# Altium schematic sheet DSP_Header.SchDoc
size A4
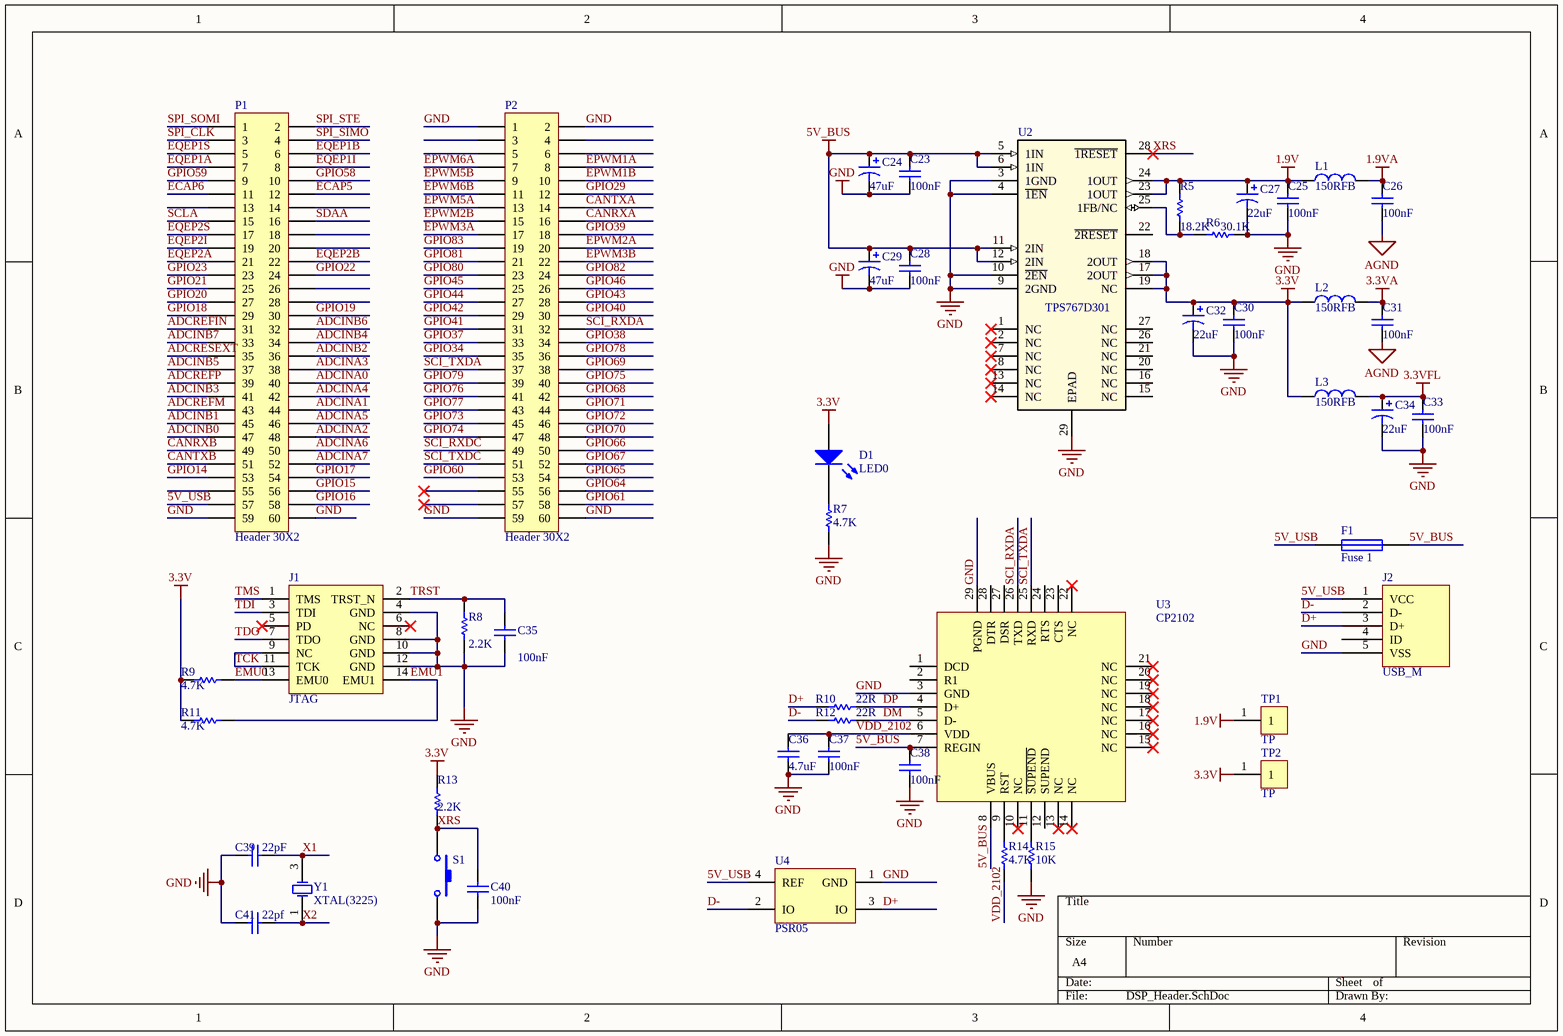
[diagram p0: DSP_Header.SchDoc]

## Parts
C23  value 100nF  [C0603]  (hidden comment: Cap)
C24  value 47uF  [C0805]  (hidden comment: Cap Pol3)
C25  value 100nF  [C0603]  (hidden comment: Cap)
C26  value 100nF  [C0603]  (hidden comment: Cap)
C27  value 22uF  [C0805]  (hidden comment: Cap Pol3)
C28  value 100nF  [C0603]  (hidden comment: Cap)
C29  value 47uF  [C0805]  (hidden comment: Cap Pol3)
C30  value 100nF  [C0603]  (hidden comment: Cap)
C31  value 100nF  [C0603]  (hidden comment: Cap)
C32  value 22uF  [C0805]  (hidden comment: Cap Pol3)
C33  value 100nF  [C0603]  (hidden comment: Cap)
C34  value 22uF  [C0805]  (hidden comment: Cap Pol3)
C35  value 100nF  [C0603]  (hidden comment: Cap)
C36  value 4.7uF  [C0603]  (hidden comment: Cap)
C37  value 100nF  [C0603]  (hidden comment: Cap)
C38  value 100nF  [C0603]  (hidden comment: Cap)
C39  value 22pF  [C0603]  (hidden comment: Cap)
C40  value 100nF  [C0603]  (hidden comment: Cap)
C41  value 22pf  [C0603]  (hidden comment: Cap)
D1  LED0  [0603D]
F1  Fuse 1  [0805R]
J1  JTAG  [HDR2X7]
J2  USB_M  [USB_MICRO_DIP]
L1  value 150RFB  [r0603]  (hidden comment: Inductors)
L2  value 150RFB  [r0603]  (hidden comment: Inductors)
L3  value 150RFB  [r0603]  (hidden comment: Inductors)
P1  Header 30X2  [0.8BTB_60P]
P2  Header 30X2  [0.8BTB_60P]
R5  value 18.2K  [r0603]  (hidden comment: Res1)
R6  value 30.1K  [r0603]  (hidden comment: Res1)
R7  value 4.7K  [R0603]  (hidden comment: Res1)
R8  value 2.2K  [r0603]  (hidden comment: Res1)
R9  value 4.7K  [R0603]  (hidden comment: Res1)
R10  value 22R  [R0603]  (hidden comment: Res1)
R11  value 4.7K  [r0603]  (hidden comment: Res1)
R12  value 22R  [R0603]  (hidden comment: Res1)
R13  value 2.2K  [r0603]  (hidden comment: Res1)
R14  value 4.7K  [R0603]  (hidden comment: Res1)
R15  value 10K  [R0603]  (hidden comment: Res1)
S1  SW-PB  [SW_3*6]  (value not drawn)
TP1  TP  [TPJ1.0]
TP2  TP  [TPJ1.0]
U2  TPS767D301  [PWP28_6P46X2P4]
U3  CP2102  [QFN28]
U4  PSR05  [SOT143]
Y1  XTAL(3225)  [Y3225]

## Nets
1.9V: C25.2 C27.1 L1.1 R5.2 TP1.1 U2.23(1OUT) U2.24(1OUT)
1.9VA: C26.2 L1.2
3.3V: C30.2 C32.1 D1.1(A) L2.1 L3.1 R9.2 R11.2 R13.2 TP2.1 U2.17(2OUT) U2.18(2OUT) U2.19(NC)
3.3VA: C31.2 L2.2
3.3VFL: C33.2 C34.1 L3.2
5V_BUS: C23.2 C24.1 C28.2 C29.1 C38.2 F1.2 U2.5(1IN) U2.6(1IN) U2.11(2IN) U2.12(2IN) U3.7(REGIN) U3.8(VBUS)
AGND: C26.1 C31.1
GND: C23.1 C24.2 C25.1 C27.2 C28.1 C29.2 C30.1 C32.2 C33.1 C34.2 C35.1 C36.1 C37.1 C38.1 C39.2 C40.2 C41.2 J1.4(GND) J1.8(GND) J1.10(GND) J1.12(GND) J2.5(VSS) P1.59 P1.60 P2.1 P2.2 P2.59 P2.60 R6.1 R7.2 R8.1 R15.2 S1.2 U2.3(1GND) U2.4(~{1EN}) U2.9(2GND) U2.10(~{2EN}) U2.29(EPAD) U3.3(GND) U3.29(PGND) U4.1(GND)
5V_USB: F1.1 J2.1(VCC) P1.57 U4.4(REF)
ADCINA0: P1.40
ADCINA1: P1.44
ADCINA2: P1.48
ADCINA3: P1.38
ADCINA4: P1.42
ADCINA5: P1.46
ADCINA6: P1.50
ADCINA7: P1.52
ADCINB0: P1.47
ADCINB1: P1.45
ADCINB2: P1.36
ADCINB3: P1.41
ADCINB4: P1.34
ADCINB5: P1.37
ADCINB6: P1.32
ADCINB7: P1.33
ADCREFIN: P1.31
ADCREFM: P1.43
ADCREFP: P1.39
ADCRESEXT: P1.35
CANRXA: P2.16
CANRXB: P1.49
CANTXA: P2.14
CANTXB: P1.51
D+: J2.3(D+) R10.2 U4.3(IO)
D-: J2.2(D-) R12.1 U4.2(IO)
DM: R12.2 U3.5(D-)
DP: R10.1 U3.4(D+)
ECAP5: P1.12
ECAP6: P1.11
EMU0: J1.13(EMU0) R9.1
EMU1: J1.14(EMU1) R11.1
EPWM1A: P2.8
EPWM1B: P2.10
EPWM2A: P2.20
EPWM2B: P2.15
EPWM3A: P2.17
EPWM3B: P2.22
EPWM5A: P2.13
EPWM5B: P2.9
EPWM6A: P2.7
EPWM6B: P2.11
EQEP1A: P1.7
EQEP1B: P1.6
EQEP1I: P1.8
EQEP1S: P1.5
EQEP2A: P1.21
EQEP2B: P1.22
EQEP2I: P1.19
EQEP2S: P1.17
GPIO14: P1.53
GPIO15: P1.56
GPIO16: P1.58
GPIO17: P1.54
GPIO18: P1.29
GPIO19: P1.30
GPIO20: P1.27
GPIO21: P1.25
GPIO22: P1.24
GPIO23: P1.23
GPIO29: P2.12
GPIO34: P2.35
GPIO37: P2.33
GPIO38: P2.34
GPIO39: P2.18
GPIO40: P2.30
GPIO41: P2.31
GPIO42: P2.29
GPIO43: P2.28
GPIO44: P2.27
GPIO45: P2.25
GPIO46: P2.26
GPIO58: P1.10
GPIO59: P1.9
GPIO60: P2.53
GPIO61: P2.58
GPIO64: P2.56
GPIO65: P2.54
GPIO66: P2.50
GPIO67: P2.52
GPIO68: P2.42
GPIO69: P2.38
GPIO70: P2.48
GPIO71: P2.44
GPIO72: P2.46
GPIO73: P2.45
GPIO74: P2.47
GPIO75: P2.40
GPIO76: P2.41
GPIO77: P2.43
GPIO78: P2.36
GPIO79: P2.39
GPIO80: P2.23
GPIO81: P2.21
GPIO82: P2.24
GPIO83: P2.19
SCI_RXDA: P2.32 U3.26(TXD)
SCI_RXDC: P2.49
SCI_TXDA: P2.37 U3.25(RXD)
SCI_TXDC: P2.51
SCLA: P1.15
SDAA: P1.16
SPI_CLK: P1.3
SPI_SIMO: P1.4
SPI_SOMI: P1.1
SPI_STE: P1.2
TCK: J1.9(NC) J1.11(TCK)
TDI: J1.3(TDI)
TDO: J1.7(TDO)
TMS: J1.1(TMS)
TRST: C35.2 J1.2(TRST_N) R8.2
VDD_2102: C36.2 C37.2 R14.2 U3.6(VDD)
X1: C39.1 Y1.3(OSC2)
X2: C41.1 Y1.1(OSC1)
XRS: C40.1 R13.1 S1.1 U2.28(~{1RESET})
NetD1_2: D1.2(K) R7.1
NetR5_1: R5.1 R6.2 U2.25(1FB/NC)
NetR14_1: R14.1 U3.9(RST)
NetR15_1: R15.1 U3.11(~{SUPEND})

Not connected (* = marked no-connect by the designer): J1 5(PD)* 6(NC)*; J2 4(ID); P1 13 14 18 20 26 28 55; P2 3 4 5 6 55* 57*; U2 1(NC)* 2(NC)* 7(NC)* 8(NC)* 13(NC)* 14(NC)* 15(NC) 16(NC) 20(NC) 21(NC) 22(~{2RESET}) 26(NC) 27(NC); U3 1(DCD) 2(R1) 10(NC)* 12(SUPEND) 13(NC)* 14(NC)* 15(NC)* 16(NC)* 17(NC)* 18(NC)* 19(NC)* 20(NC)* 21(NC)* 22(NC)* 23(CTS) 24(RTS) 27(DSR) 28(DTR)

## Library data of the parts
C23 C25 C26 C28 C30 C31 C33 C35-C41 = Cap: Capacitor; Published: 8-Jun-2000; LatestRevisionDate: 17-Jul-2002; LatestRevisionNote: Re-released for DXP Platform.; PackageReference: RAD-0.3; Publisher: Altium Limited; PackageDescription: Radial Cap, Thru-Hole; 2 Leads; 0.3 in Pin Spacing
C24 C27 C29 C32 C34 = Cap Pol3: Polarized Capacitor (Surface Mount); Published: 8-Jun-2000; LatestRevisionDate: 29-May-2009; LatestRevisionNote: IPC-7351 Footprint Added.; PackageReference: C0805; Publisher: Altium Limited; PackageDescription: Chip Capacitor
D1 = LED0: Typical INFRARED GaAs LED; Published: 8-Jun-2000; LatestRevisionDate: 08-Jul-2005; LatestRevisionNote: Mech Layer 1 removed.; PackageReference: LED-0; Publisher: Altium Limited
F1 = Fuse 1: Fuse; Published: 8-Jun-2000; LatestRevisionDate: 17-Jul-2002; LatestRevisionNote: Re-released for DXP Platform.; PackageReference: PIN-W2/E2.8; Publisher: Altium Limited; PackageDescription: Thru-Hole; 2 Leads
J2 = USB_M: MicroUSB接口
P1 P2 = Header 30X2: Header, 30-Pin, Dual row; LatestRevisionDate: 17-Jul-2002; LatestRevisionNote: Re-released for DXP Platform.; Publisher: Altium Limited
R5-R15 = Res1: Resistor; Published: 8-Jun-2000; LatestRevisionDate: 17-Jul-2002; LatestRevisionNote: Re-released for DXP Platform.; PackageReference: AXIAL-0.3; Publisher: Altium Limited
  R5 R6 R8 R9 R11 R13: PackageDescription: Axial Device, Thru-Hole; 2 Leads; 0.3 in Pin Spacing
S1 = SW-PB: Switch; Published: 24-Mar-1999; LatestRevisionDate: 17-Jul-2002; LatestRevisionNote: Re-released for DXP Platform.; PackageReference: SPST-2; Publisher: Altium Limited; PackageDescription: Switch; 2 Leads
U2 = TPS767D301: Imported; Manufacturer_Part_Number: tps767d301-ep_pwp_28; GENERIC_PART_NUMBER: TPS767D301-EP; Vendor: Texas Instruments; PACKAGE_DESIGNATOR: PWP; PIN_COUNT: 28; FAMILY_NAME: DUAL CHANNEL LDO; INDUSTRY_STD_PKG_TYPE: HTSSOP; Manufacturer: Texas Instruments; Datasheet_URL: http://www.ti.com/lit/gpn/TPS767D301-EP; Value: Value; Type: Type; RefDes: RefDes
Y1 = XTAL(3225): Crystal Oscillator; Published: 8-Jun-2000; LatestRevisionDate: 17-Jul-2002; LatestRevisionNote: Re-released for DXP Platform.; PackageReference: R38; Publisher: Altium Limited